# EAGLE schematic M224X (EAGLE 6.6.0)
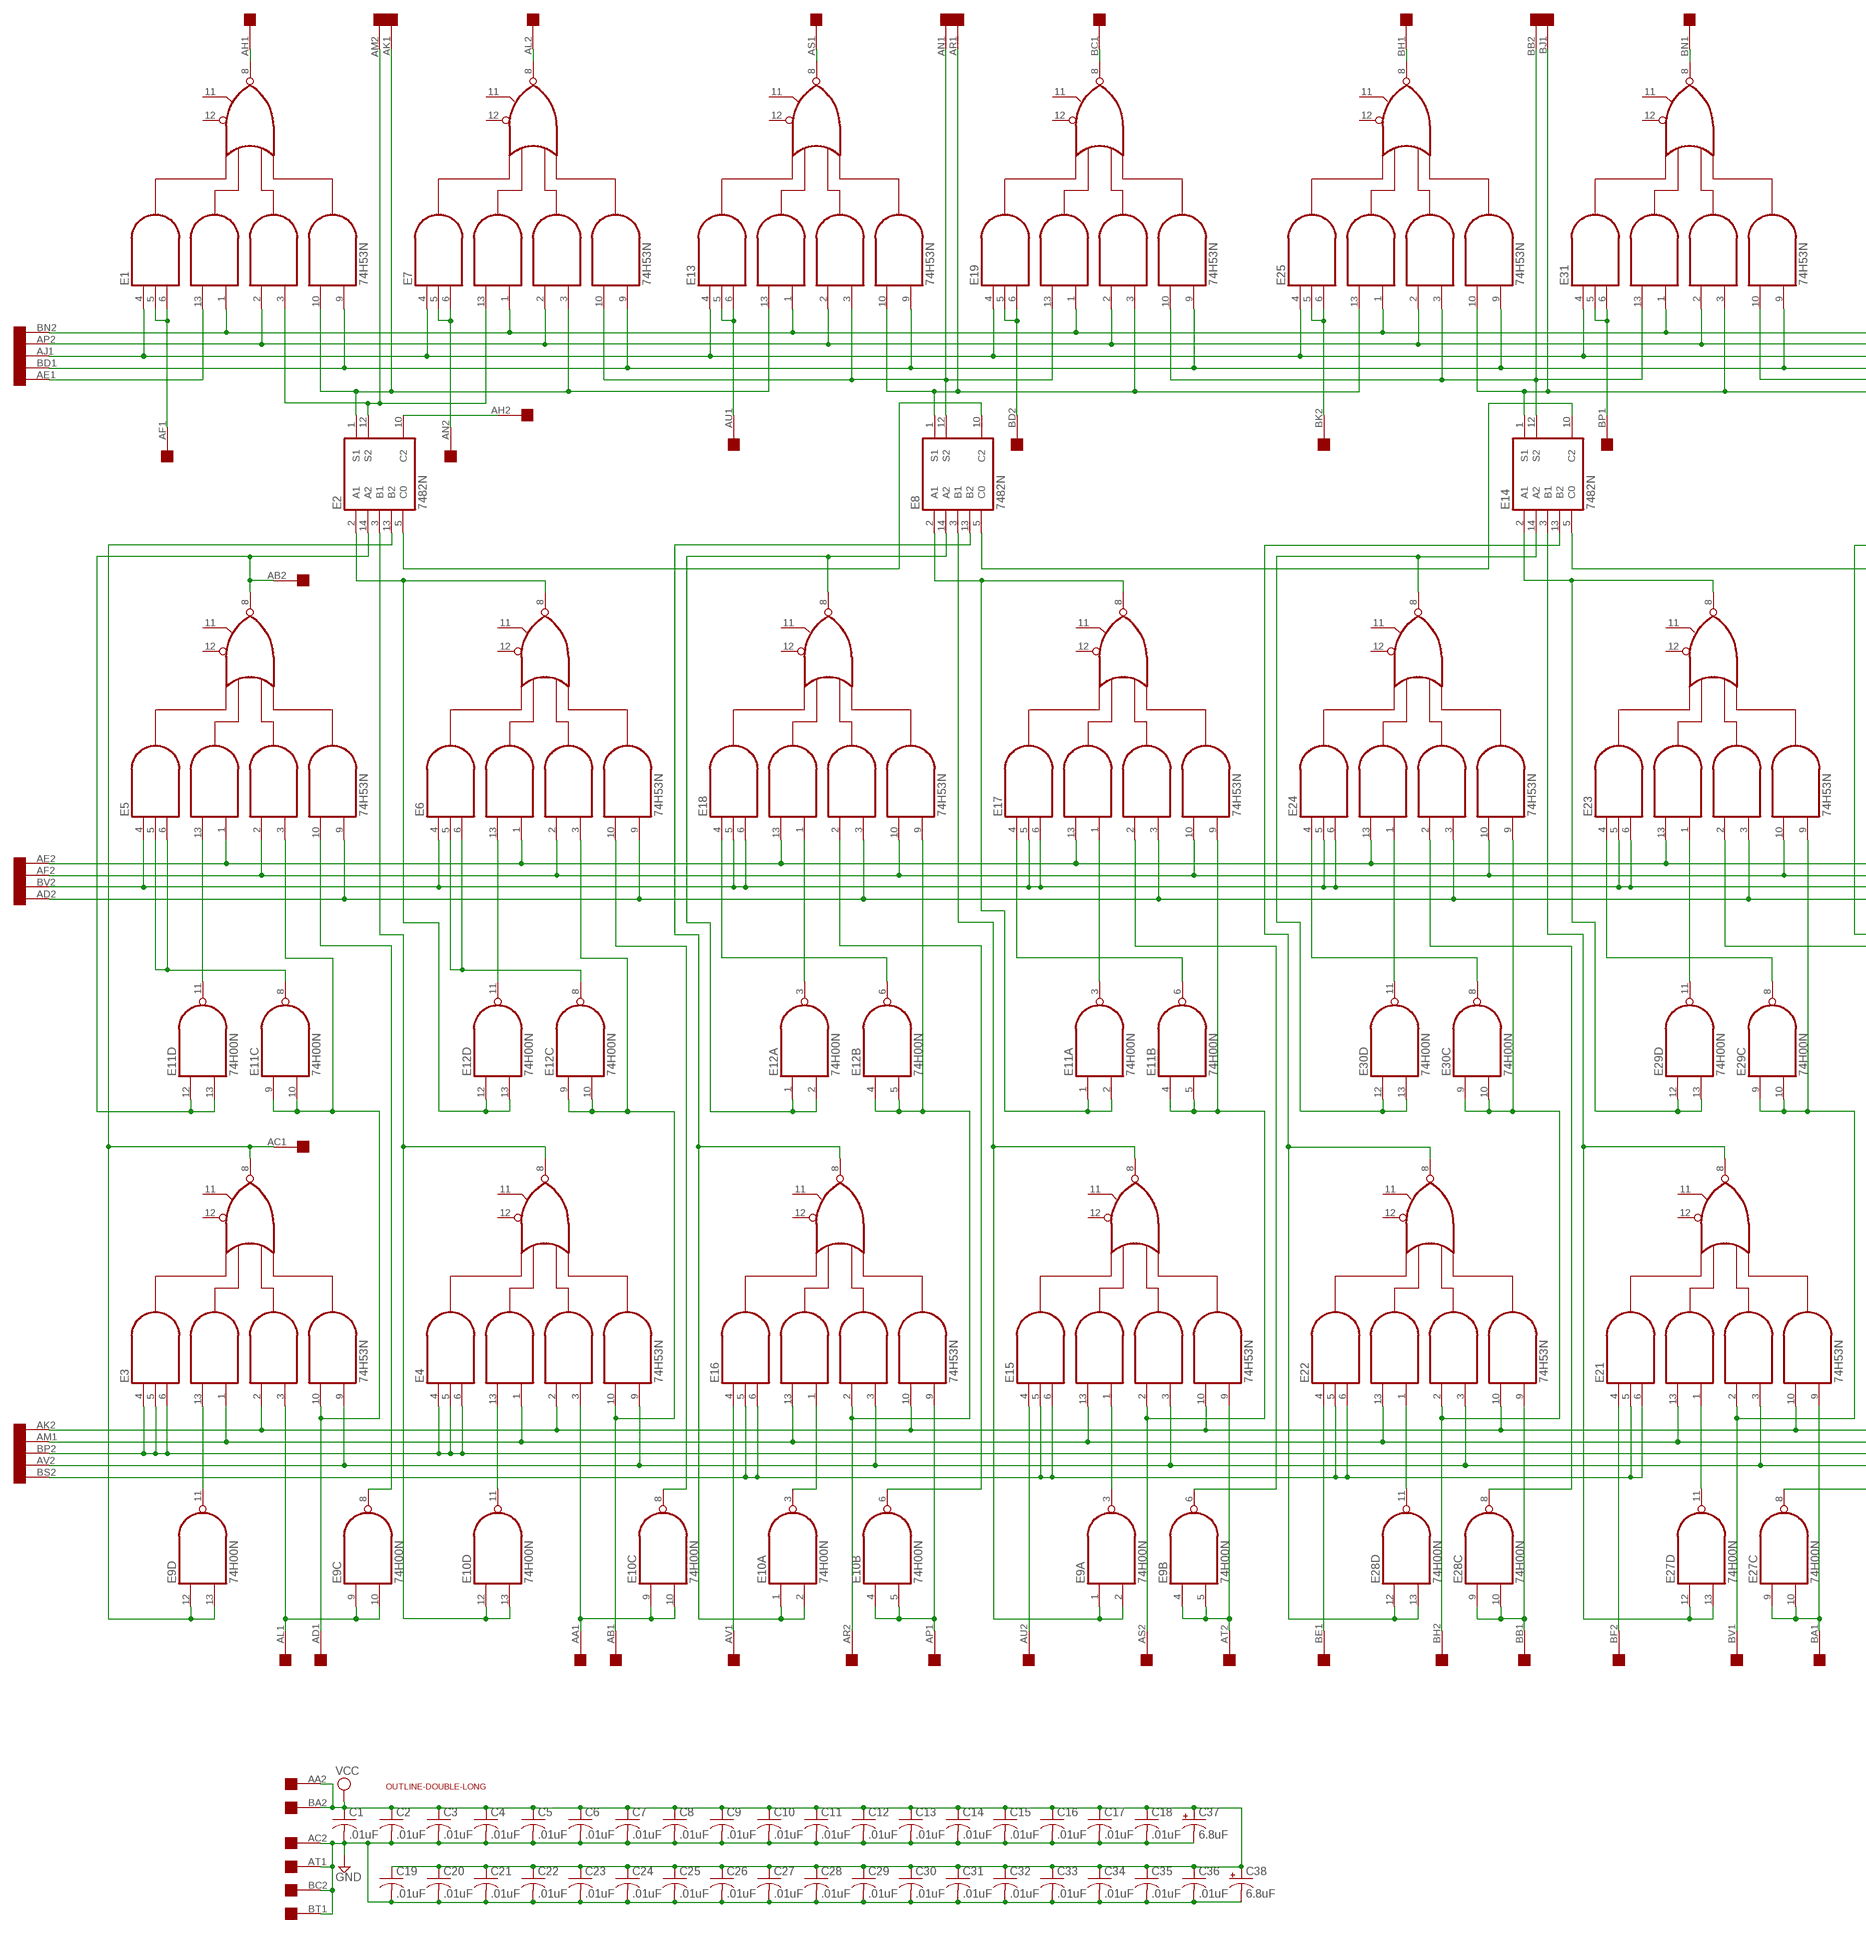
[diagram p0: schematic, sheet 1, part 1 of 2]
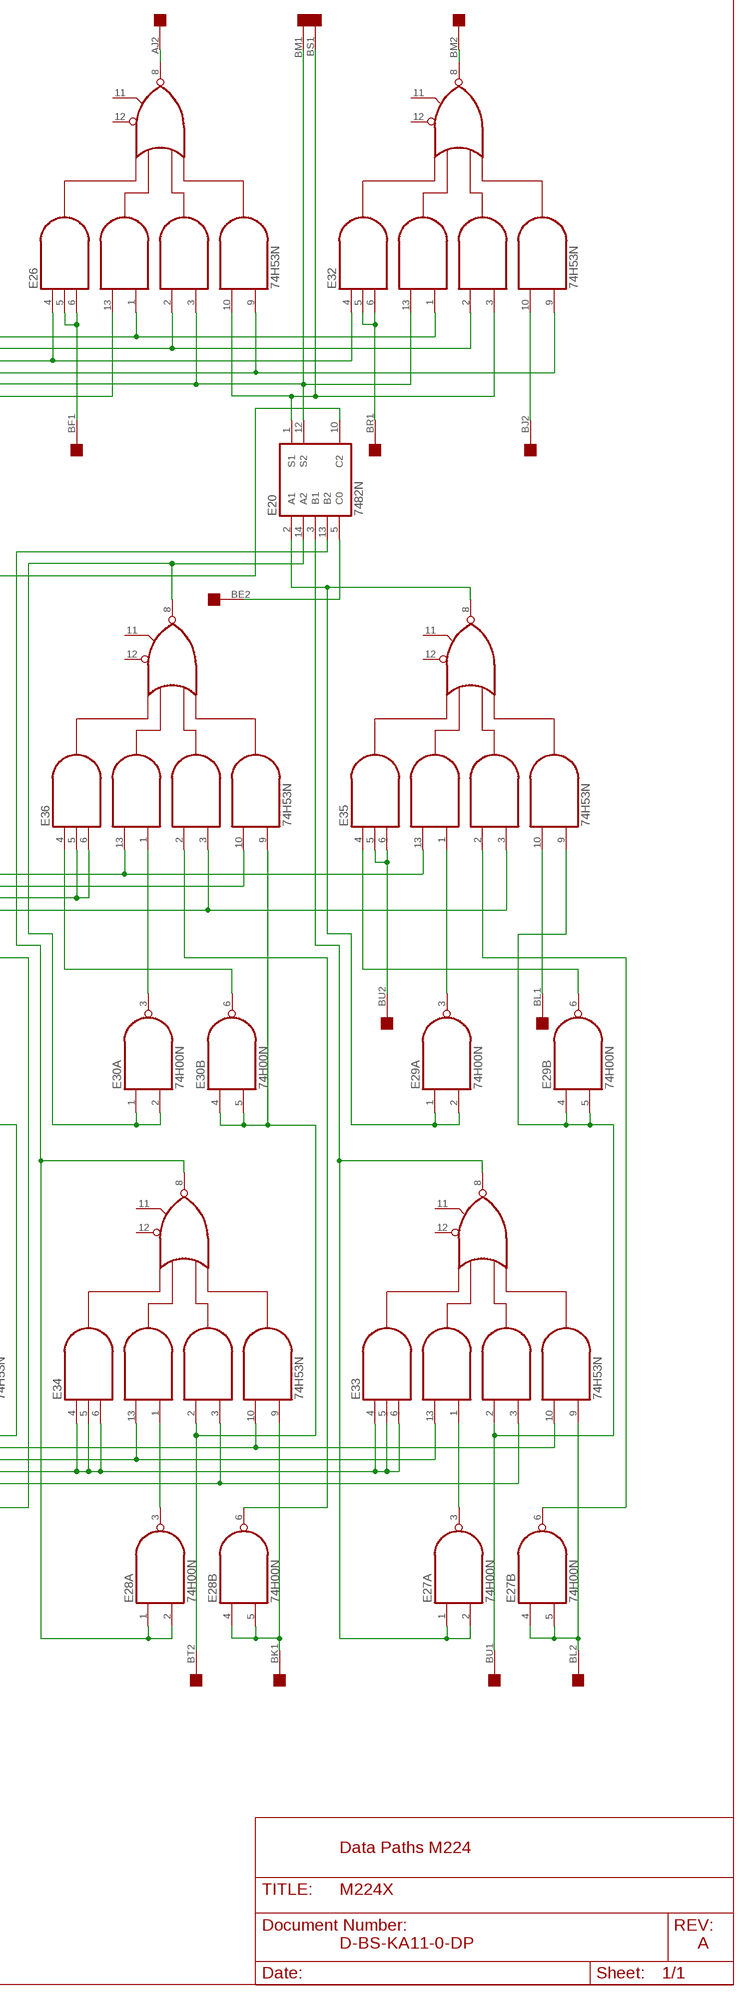
[diagram p1: schematic, sheet 1, part 2 of 2]

## Parts
C1  .01uF  C-US050-025X075  [C050-025X075]
C2  .01uF  C-US050-025X075  [C050-025X075]
C3  .01uF  C-US050-025X075  [C050-025X075]
C4  .01uF  C-US050-025X075  [C050-025X075]
C5  .01uF  C-US050-025X075  [C050-025X075]
C6  .01uF  C-US050-025X075  [C050-025X075]
C7  .01uF  C-US050-025X075  [C050-025X075]
C8  .01uF  C-US050-025X075  [C050-025X075]
C9  .01uF  C-US050-025X075  [C050-025X075]
C10  .01uF  C-US050-025X075  [C050-025X075]
C11  .01uF  C-US050-025X075  [C050-025X075]
C12  .01uF  C-US050-025X075  [C050-025X075]
C13  .01uF  C-US050-025X075  [C050-025X075]
C14  .01uF  C-US050-025X075  [C050-025X075]
C15  .01uF  C-US050-025X075  [C050-025X075]
C16  .01uF  C-US050-025X075  [C050-025X075]
C17  .01uF  C-US050-025X075  [C050-025X075]
C18  .01uF  C-US050-025X075  [C050-025X075]
C19  .01uF  C-US050-025X075  [C050-025X075]
C20  .01uF  C-US050-025X075  [C050-025X075]
C21  .01uF  C-US050-025X075  [C050-025X075]
C22  .01uF  C-US050-025X075  [C050-025X075]
C23  .01uF  C-US050-025X075  [C050-025X075]
C24  .01uF  C-US050-025X075  [C050-025X075]
C25  .01uF  C-US050-025X075  [C050-025X075]
C26  .01uF  C-US050-025X075  [C050-025X075]
C27  .01uF  C-US050-025X075  [C050-025X075]
C28  .01uF  C-US050-025X075  [C050-025X075]
C29  .01uF  C-US050-025X075  [C050-025X075]
C30  .01uF  C-US050-025X075  [C050-025X075]
C31  .01uF  C-US050-025X075  [C050-025X075]
C32  .01uF  C-US050-025X075  [C050-025X075]
C33  .01uF  C-US050-025X075  [C050-025X075]
C34  .01uF  C-US050-025X075  [C050-025X075]
C35  .01uF  C-US050-025X075  [C050-025X075]
C36  .01uF  C-US050-025X075  [C050-025X075]
C37  6.8uF  CPOL-USE20-8AXIAL  [E12-8]
C38  6.8uF  CPOL-USE20-8AXIAL  [E12-8]
E1  74H53N  [DIL14]
E2  7482N  [DIL14]
E3  74H53N  [DIL14]
E4  74H53N  [DIL14]
E5  74H53N  [DIL14]
E6  74H53N  [DIL14]
E7  74H53N  [DIL14]
E8  7482N  [DIL14]
E9  74H00N  74S00N  [DIL14]
E10  74H00N  74S00N  [DIL14]
E11  74H00N  74S00N  [DIL14]
E12  74H00N  74S00N  [DIL14]
E13  74H53N  [DIL14]
E14  7482N  [DIL14]
E15  74H53N  [DIL14]
E16  74H53N  [DIL14]
E17  74H53N  [DIL14]
E18  74H53N  [DIL14]
E19  74H53N  [DIL14]
E20  7482N  [DIL14]
E21  74H53N  [DIL14]
E22  74H53N  [DIL14]
E23  74H53N  [DIL14]
E24  74H53N  [DIL14]
E25  74H53N  [DIL14]
E26  74H53N  [DIL14]
E27  74H00N  74S00N  [DIL14]
E28  74H00N  74S00N  [DIL14]
E29  74H00N  74S00N  [DIL14]
E30  74H00N  74S00N  [DIL14]
E31  74H53N  [DIL14]
E32  74H53N  [DIL14]
E33  74H53N  [DIL14]
E34  74H53N  [DIL14]
E35  74H53N  [DIL14]
E36  74H53N  [DIL14]
U$1  OUTLINE-DOUBLE-LONG  [DOUBLE-LONG]
U$3  DOUBLE  [EDGE-CON4]

## Nets
GND [supply]: C1.2 C2.2 C3.2 C4.2 C5.2 C6.2 C7.2 C8.2 C9.2 C10.2 C11.2 C12.2 C13.2 C14.2 C15.2 C16.2 C17.2 C18.2 C19.2 C20.2 C21.2 C22.2 C23.2 C24.2 C25.2 C26.2 C27.2 C28.2 C29.2 C30.2 C31.2 C32.2 C33.2 C34.2 C35.2 C36.2 C37.- C38.- U$3.AC2 U$3.AT1 U$3.BC2 U$3.BT1
N$1: E3.2(I5) E4.2(I5) E15.10(I7) E16.10(I7) E21.10(I7) E22.10(I7) E33.10(I7) E34.10(I7) U$3.AK2
N$2: E3.1(I4) E4.1(I4) E15.13(I3) E16.13(I3) E21.13(I3) E22.13(I3) E33.13(I3) E34.13(I3) U$3.AM1
N$3: E3.4(I1) E3.5(I11) E3.6(I2) E4.4(I1) E4.5(I11) E4.6(I2) E33.4(I1) E33.5(I11) E33.6(I2) E34.4(I1) E34.5(I11) E34.6(I2) U$3.BP2
N$4: E3.9(I8) E4.9(I8) E15.3(I6) E16.3(I6) E21.3(I6) E22.3(I6) E33.3(I6) E34.3(I6) U$3.AV2
N$5: E3.13(I3) E9.11(D:O)
N$6: E3.3(I6) E9.9(C:I0) E9.10(C:I1) U$3.AL1
N$7: E3.10(I7) E5.3(I6) E11.9(C:I0) E11.10(C:I1) U$3.AD1
N$8: E2.13(B2) E3.8(O) E9.12(D:I0) E9.13(D:I1) U$3.AC1
N$9: E35.5(I11) E35.6(I2) U$3.BU2
N$10: E5.10(I7) E9.8(C:O)
N$11: E2.3(B1) E4.8(O) E10.12(D:I0) E10.13(D:I1)
N$12: E5.1(I4) E6.1(I4) E17.13(I3) E18.13(I3) E23.13(I3) E24.13(I3) E35.13(I3) E36.13(I3) U$3.AE2
N$13: E5.2(I5) E6.2(I5) E17.10(I7) E18.10(I7) E23.10(I7) E24.10(I7) E36.10(I7) U$3.AF2
N$14: E5.13(I3) E11.11(D:O)
N$15: E2.14(A2) E5.8(O) E11.12(D:I0) E11.13(D:I1) U$3.AB2
N$16: E5.4(I1) E6.4(I1) E17.5(I11) E17.6(I2) E18.5(I11) E18.6(I2) E23.5(I11) E23.6(I2) E24.5(I11) E24.6(I2) E36.5(I11) E36.6(I2) U$3.BV2
N$17: E5.5(I11) E5.6(I2) E11.8(C:O)
N$18: E5.9(I8) E6.9(I8) E17.3(I6) E18.3(I6) E23.3(I6) E24.3(I6) E35.3(I6) E36.3(I6) U$3.AD2
N$19: E35.10(I7) U$3.BL1
N$20: E15.5(I11) E15.6(I2) E16.5(I11) E16.6(I2) E21.5(I11) E21.6(I2) E22.5(I11) E22.6(I2) U$3.BS2
N$21: E1.3(I6) E2.12(S2) E7.13(I3) U$3.AM2
N$22: E2.2(A1) E6.8(O) E12.12(D:I0) E12.13(D:I1)
N$23: E1.10(I7) E2.1(S1) E7.3(I6) E13.13(I3) U$3.AK1
N$24: E1.8(O) U$3.AH1
N$25: E7.8(O) U$3.AL2
N$26: E1.13(I3) U$3.AE1
N$27: E1.1(I4) E7.1(I4) E13.1(I4) E19.1(I4) E25.1(I4) E26.1(I4) E31.1(I4) E32.1(I4) U$3.BN2
N$28: E1.2(I5) E7.2(I5) E13.2(I5) E19.2(I5) E25.2(I5) E26.2(I5) E31.2(I5) E32.2(I5) U$3.AP2
N$29: E1.4(I1) E7.4(I1) E13.4(I1) E19.4(I1) E25.4(I1) E26.4(I1) E31.4(I1) E32.4(I1) U$3.AJ1
N$30: E1.9(I8) E7.9(I8) E13.9(I8) E19.9(I8) E25.9(I8) E26.9(I8) E31.9(I8) E32.9(I8) U$3.BD1
N$31: E1.5(I11) E1.6(I2) U$3.AF1
N$32: E4.3(I6) E10.9(C:I0) E10.10(C:I1) U$3.AA1
N$33: E4.13(I3) E10.11(D:O)
N$34: E6.10(I7) E10.8(C:O)
N$35: E4.10(I7) E6.3(I6) E12.9(C:I0) E12.10(C:I1) U$3.AB1
N$36: E6.13(I3) E12.11(D:O)
N$37: E6.5(I11) E6.6(I2) E12.8(C:O)
N$38: E13.8(O) U$3.AS1
N$39: E19.8(O) U$3.BC1
N$40: E25.8(O) U$3.BH1
N$41: E7.5(I11) E7.6(I2) U$3.AN2
N$42: E7.10(I7) E8.12(S2) E13.3(I6) E19.13(I3) U$3.AN1
N$43: E2.10(C2) U$3.AH2
N$44: E2.5(C0) E8.10(C2)
N$45: E31.8(O) U$3.BN1
N$46: E32.8(O) U$3.BM2
N$47: E26.8(O) U$3.AJ2
N$48: E20.5(C0) U$3.BE2
N$49: E10.4(B:I0) E10.5(B:I1) E16.9(I8) U$3.AP1
N$50: E10.6(B:O) E18.2(I5)
N$51: E12.4(B:I0) E12.5(B:I1) E16.2(I5) E18.9(I8) U$3.AR2
N$52: E16.4(I1) U$3.AV1
N$53: E8.13(B2) E10.1(A:I0) E10.2(A:I1) E16.8(O)
N$54: E10.3(A:O) E16.1(I4)
N$55: E8.3(B1) E9.1(A:I0) E9.2(A:I1) E15.8(O)
N$56: E13.5(I11) E13.6(I2) U$3.AU1
N$57: E8.14(A2) E12.1(A:I0) E12.2(A:I1) E18.8(O)
N$58: E19.5(I11) E19.6(I2) U$3.BD2
N$59: E8.2(A1) E11.1(A:I0) E11.2(A:I1) E17.8(O)
N$60: E8.1(S1) E13.10(I7) E19.3(I6) E25.13(I3) U$3.AR1
N$61: E25.5(I11) E25.6(I2) U$3.BK2
N$62: E31.5(I11) E31.6(I2) U$3.BP1
N$63: E26.5(I11) E26.6(I2) U$3.BF1
N$64: E9.3(A:O) E15.1(I4)
N$65: E32.5(I11) E32.6(I2) U$3.BR1
N$66: E32.10(I7) U$3.BJ2
N$67: E9.4(B:I0) E9.5(B:I1) E15.9(I8) U$3.AT2
N$68: E24.2(I5) E28.8(C:O)
N$69: E15.4(I1) U$3.AU2
N$70: E11.4(B:I0) E11.5(B:I1) E15.2(I5) E17.9(I8) U$3.AS2
N$71: E22.1(I4) E28.11(D:O)
N$72: E22.9(I8) E28.9(C:I0) E28.10(C:I1) U$3.BB1
N$73: E27.6(B:O) E35.2(I5)
N$74: E14.13(B2) E22.8(O) E28.12(D:I0) E28.13(D:I1)
N$75: E14.3(B1) E21.8(O) E27.12(D:I0) E27.13(D:I1)
N$76: E22.2(I5) E24.9(I8) E30.9(C:I0) E30.10(C:I1) U$3.BH2
N$77: E21.2(I5) E23.9(I8) E29.9(C:I0) E29.10(C:I1) U$3.BV1
N$78: E22.4(I1) U$3.BE1
N$79: E21.1(I4) E27.11(D:O)
N$80: E21.9(I8) E27.9(C:I0) E27.10(C:I1) U$3.BA1
N$81: E21.4(I1) U$3.BF2
N$82: E23.2(I5) E27.8(C:O)
N$83: E20.13(B2) E28.1(A:I0) E28.2(A:I1) E34.8(O)
N$84: E27.4(B:I0) E27.5(B:I1) E33.9(I8) U$3.BL2
N$85: E12.3(A:O) E18.1(I4)
N$86: E20.3(B1) E27.1(A:I0) E27.2(A:I1) E33.8(O)
N$87: E28.3(A:O) E34.1(I4)
N$88: E28.4(B:I0) E28.5(B:I1) E34.9(I8) U$3.BK1
N$89: E30.4(B:I0) E30.5(B:I1) E34.2(I5) E36.9(I8) U$3.BT2
N$90: E28.6(B:O) E36.2(I5)
N$91: E29.4(B:I0) E29.5(B:I1) E33.2(I5) E35.9(I8) U$3.BU1
N$92: E14.12(S2) E19.10(I7) E25.3(I6) E31.13(I3) U$3.BB2
N$93: E27.3(A:O) E33.1(I4)
N$94: E11.3(A:O) E17.1(I4)
N$95: E24.1(I4) E30.11(D:O)
N$96: E23.1(I4) E29.11(D:O)
N$97: E30.3(A:O) E36.1(I4)
N$98: E29.3(A:O) E35.1(I4)
N$99: E11.6(B:O) E17.4(I1)
N$100: E12.6(B:O) E18.4(I1)
N$101: E24.4(I1) E30.8(C:O)
N$102: E23.4(I1) E29.8(C:O)
N$103: E9.6(B:O) E17.2(I5)
N$104: E30.6(B:O) E36.4(I1)
N$105: E29.6(B:O) E35.4(I1)
N$106: E14.14(A2) E24.8(O) E30.12(D:I0) E30.13(D:I1)
N$107: E20.2(A1) E29.1(A:I0) E29.2(A:I1) E35.8(O)
N$108: E20.14(A2) E30.1(A:I0) E30.2(A:I1) E36.8(O)
N$109: E14.2(A1) E23.8(O) E29.12(D:I0) E29.13(D:I1)
N$111: E20.12(S2) E26.3(I6) E31.10(I7) E32.13(I3) U$3.BM1
N$112: E8.5(C0) E14.10(C2)
N$113: E14.5(C0) E20.10(C2)
N$114: E14.1(S1) E25.10(I7) E26.13(I3) E31.3(I6) U$3.BJ1
N$115: E20.1(S1) E26.10(I7) E32.3(I6) U$3.BS1
VCC [supply]: C1.1 C2.1 C3.1 C4.1 C5.1 C6.1 C7.1 C8.1 C9.1 C10.1 C11.1 C12.1 C13.1 C14.1 C15.1 C16.1 C17.1 C18.1 C19.1 C20.1 C21.1 C22.1 C23.1 C24.1 C25.1 C26.1 C27.1 C28.1 C29.1 C30.1 C31.1 C32.1 C33.1 C34.1 C35.1 C36.1 C37.+ C38.+ U$3.AA2 U$3.BA2
Unconnected: E1.11(I10) E1.12(I9) E2.6 E2.7 E2.8 E2.9 E3.11(I10) E3.12(I9) E4.11(I10) E4.12(I9) E5.11(I10) E5.12(I9) E6.11(I10) E6.12(I9) E7.11(I10) E7.12(I9) E8.6 E8.7 E8.8 E8.9 E13.11(I10) E13.12(I9) E14.6 E14.7 E14.8 E14.9 E15.11(I10) E15.12(I9) E16.11(I10) E16.12(I9) E17.11(I10) E17.12(I9) E18.11(I10) E18.12(I9) E19.11(I10) E19.12(I9) E20.6 E20.7 E20.8 E20.9 E21.11(I10) E21.12(I9) E22.11(I10) E22.12(I9) E23.11(I10) E23.12(I9) E24.11(I10) E24.12(I9) E25.11(I10) E25.12(I9) E26.11(I10) E26.12(I9) E31.11(I10) E31.12(I9) E32.11(I10) E32.12(I9) E33.11(I10) E33.12(I9) E34.11(I10) E34.12(I9) E35.11(I10) E35.12(I9) E36.11(I10) E36.12(I9) U$3.BR2

## Notes on the sheet
- Data Paths M224
- D-BS-KA11-0-DP | A

## Power pins joined to a net without a drawn wire
GND: E1.7(GND) E2.11(GND) E3.7(GND) E4.7(GND) E5.7(GND) E6.7(GND) E7.7(GND) E8.11(GND) E9.7(P:GND) E10.7(P:GND) E11.7(P:GND) E12.7(P:GND) E13.7(GND) E14.11(GND) E15.7(GND) E16.7(GND) E17.7(GND) E18.7(GND) E19.7(GND) E20.11(GND) E21.7(GND) E22.7(GND) E23.7(GND) E24.7(GND) E25.7(GND) E26.7(GND) E27.7(P:GND) E28.7(P:GND) E29.7(P:GND) E30.7(P:GND) E31.7(GND) E32.7(GND) E33.7(GND) E34.7(GND) E35.7(GND) E36.7(GND)
VCC: E1.14(VCC) E2.4(VCC) E3.14(VCC) E4.14(VCC) E5.14(VCC) E6.14(VCC) E7.14(VCC) E8.4(VCC) E9.14(P:VCC) E10.14(P:VCC) E11.14(P:VCC) E12.14(P:VCC) E13.14(VCC) E14.4(VCC) E15.14(VCC) E16.14(VCC) E17.14(VCC) E18.14(VCC) E19.14(VCC) E20.4(VCC) E21.14(VCC) E22.14(VCC) E23.14(VCC) E24.14(VCC) E25.14(VCC) E26.14(VCC) E27.14(P:VCC) E28.14(P:VCC) E29.14(P:VCC) E30.14(P:VCC) E31.14(VCC) E32.14(VCC) E33.14(VCC) E34.14(VCC) E35.14(VCC) E36.14(VCC)

## Library data of the parts
C1-C36 = rcl:C-US: CAPACITOR, American symbol
C37 C38 = dec-con:CPOL-USE20-8AXIAL: A 0.8 inch electrolytic.
E1 E3-E7 E13 E15-E19 E21-E26 E31-E36 = dec-con:74H53N: 2-2-2-3 Input And-Or-Invert Gate
E2 E8 E14 E20 = dec-con:74*82: 2-bit binary full ADDER Has the wrong GND pin in other libraries.
E9-E12 E27-E30 = 74xx-us:74*00: Quad 2-input NAND gate
U$1 = dec-con:OUTLINE-*: Board outlines for DEC boards.
U$3 = dec-con:DOUBLE: Double-Height DEC board

## Net classes
1 supply: width 0.813 mm